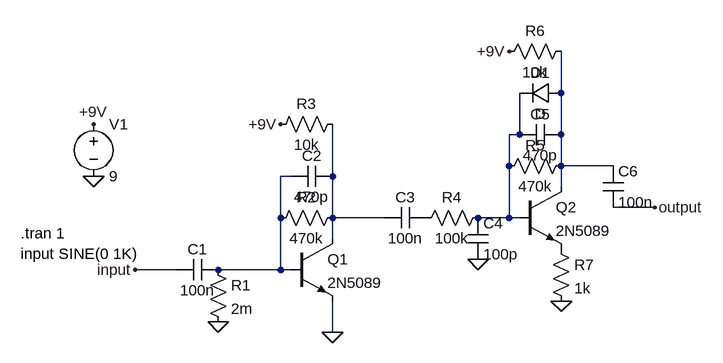
[diagram p0: schematic Bazz Fuss.asc]
Bazz Fuss.asc, the LTspice schematic file:
Version 4
SHEET 1 880 680
WIRE 624 0 624 -64
WIRE 560 64 560 0
WIRE 560 64 544 64
WIRE 624 64 624 0
WIRE 544 112 544 64
WIRE 624 112 624 64
WIRE 704 112 624 112
WIRE 208 128 192 128
WIRE 272 128 272 48
WIRE 624 144 624 112
WIRE 768 176 704 176
WIRE 192 192 192 128
WIRE 272 192 272 128
WIRE 352 192 272 192
WIRE 544 192 544 112
WIRE 544 192 496 192
WIRE 560 192 544 192
WIRE 272 224 272 192
WIRE 32 272 -32 272
WIRE 192 272 192 192
WIRE 192 272 96 272
WIRE 208 272 192 272
WIRE 272 368 272 320
FLAG -32 272 input
FLAG 272 368 0
FLAG 96 352 0
FLAG -96 48 +9V
FLAG -96 128 0
FLAG 192 48 +9V
FLAG 496 256 0
FLAG 544 -64 +9V
FLAG 624 320 0
FLAG 768 176 output
SYMBOL cap 96 256 R90
WINDOW 0 0 32 VBottom 2
WINDOW 3 32 32 VTop 2
SYMATTR InstName C1
SYMATTR Value 100n
SYMBOL res 80 256 R0
SYMATTR InstName R1
SYMATTR Value 2m
SYMBOL npn 208 224 R0
SYMATTR InstName Q1
SYMATTR Value 2N5089
SYMBOL res 288 176 R90
WINDOW 0 0 56 VBottom 2
WINDOW 3 32 56 VTop 2
SYMATTR InstName R2
SYMATTR Value 470k
SYMBOL cap 272 112 R90
WINDOW 0 0 32 VBottom 2
WINDOW 3 32 32 VTop 2
SYMATTR InstName C2
SYMATTR Value 470p
SYMBOL voltage -96 32 R0
SYMATTR InstName V1
SYMATTR Value 9
SYMBOL res 288 32 R90
WINDOW 0 0 56 VBottom 2
WINDOW 3 32 56 VTop 2
SYMATTR InstName R3
SYMATTR Value 10k
SYMBOL cap 416 176 R90
WINDOW 0 0 32 VBottom 2
WINDOW 3 32 32 VTop 2
SYMATTR InstName C3
SYMATTR Value 100n
SYMBOL res 512 176 R90
WINDOW 0 0 56 VBottom 2
WINDOW 3 32 56 VTop 2
SYMATTR InstName R4
SYMATTR Value 100k
SYMBOL cap 480 192 R0
SYMATTR InstName C4
SYMATTR Value 100p
SYMBOL npn 560 144 R0
SYMATTR InstName Q2
SYMATTR Value 2N5089
SYMBOL res 640 96 R90
WINDOW 0 0 56 VBottom 2
WINDOW 3 32 56 VTop 2
SYMATTR InstName R5
SYMATTR Value 470k
SYMBOL cap 624 48 R90
WINDOW 0 0 32 VBottom 2
WINDOW 3 32 32 VTop 2
SYMATTR InstName C5
SYMATTR Value 470p
SYMBOL diode 624 -16 R90
WINDOW 0 0 32 VBottom 2
WINDOW 3 32 32 VTop 2
SYMATTR InstName D1
SYMBOL res 640 -80 R90
WINDOW 0 0 56 VBottom 2
WINDOW 3 32 56 VTop 2
SYMATTR InstName R6
SYMATTR Value 10k
SYMBOL res 608 224 R0
SYMATTR InstName R7
SYMATTR Value 1k
SYMBOL cap 688 112 R0
SYMATTR InstName C6
SYMATTR Value 100n
TEXT -208 216 Left 2 !.tran 1\ninput SINE(0 1K)

The netlist it stands for:
* Bazz Fuss.asc
C1 N003 input 100n
R1 N003 0 2m
Q1 N004 N003 0 0 2N5089
R2 N004 N003 470k
C2 N004 N003 470p
V1 +9V 0 9
R3 N004 +9V 10k
C3 P001 N004 100n
R4 N002 P001 100k
C4 N002 0 100p
Q2 N001 N002 P002 0 2N5089
R5 N001 N002 470k
C5 N001 N002 470p
D1 N001 N002 D
R6 N001 +9V 10k
R7 P002 0 1k
C6 N001 output 100n
.model D D
.lib standard.dio
.model NPN NPN
.model PNP PNP
.lib standard.bjt
.tran 1
input SINE(0 1K)
.backanno
.end